# Altium project MachLoa.PrjPCB
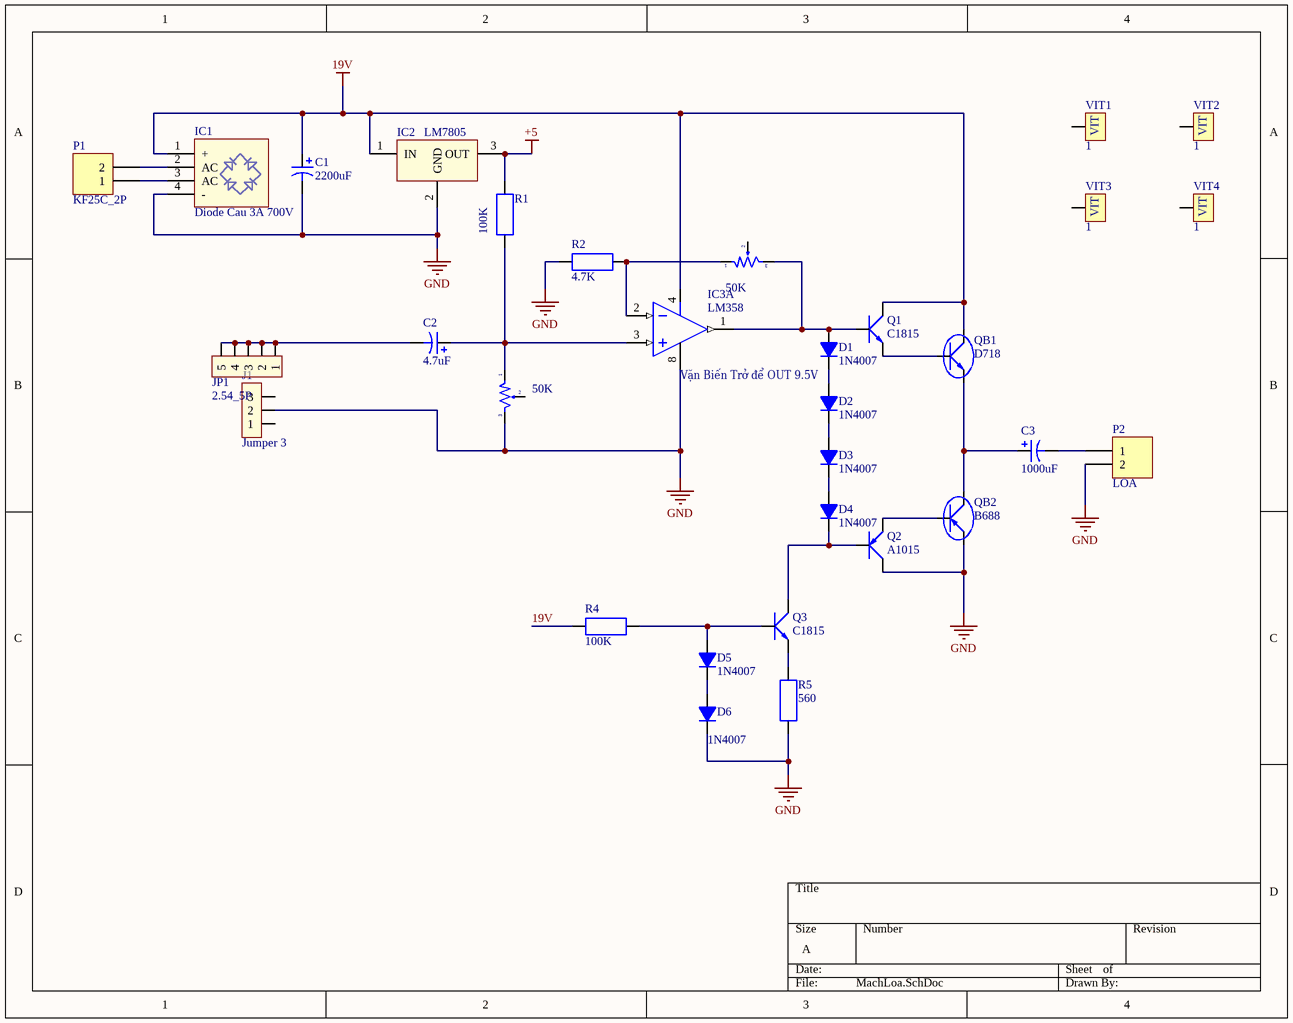
[diagram p0: MachLoa.SchDoc]
1 sheet, 31 parts. Net scope: global (net labels, ports and power ports of the same name join across sheets).
Board file: MachLoa.PcbDoc

## Sheet MachLoa.SchDoc
size A

### Parts
C1  2200uF  [C10mm]
C2  4.7uF  [C10mm]
C3  1000uF  [C10mm]
D1  1N4007  [D1A]
D2  1N4007  [D1A]
D3  1N4007  [D1A]
D4  1N4007  [D1A]
D5  1N4007  [D1A]
D6  1N4007  [D1A]
IC1  Diode Cau 3A 700V  [diode cau]
IC2  LM7805  [QTO-220H3]
IC3  LM358  [DIP8/W0.3]  (part A of 2)
J1  Jumper 3  [JP3]
JP1  2.54_5P  [jump don duc 2.54_5p]
P1  KF25C_2P  [KF25C_2P]
P2  LOA  [KF25C_2P]
Q1  C1815  [QTO-92]
Q2  A1015  [QTO-92]
Q3  C1815  [QTO-92]
QB1  D718  [QTO-247]
QB2  B688  [QTO-247]
R1  100K  [R2W]
R2  4.7K  [R2W]
R4  100K  [R2W]
R5  560  [R2W]
VIT1  1  [VIT]
VIT2  1  [VIT]
VIT3  1  [VIT]
VIT4  1  [VIT]
Volum1  50K  [BIEN TRO VI CHINH Dung]  (part A of 2)
Volum2  50K  [VOL-D]  (part A of 2)

### Nets
19V: C1.1 IC1.1(+) IC2.1(IN) IC3.4(-V) Q1.2(C) QB1.2(C) R4.2
+5: IC2.3(OUT) R1.2
GND: C1.2 D6.2(K) IC1.4(-) IC2.2(GND) IC3.8(+V) J1.2 P2.2 Q2.2(C) QB2.3(E) R2.2 R5.2 Volum1.3
NetC2_1: C2.1 IC3.3(IN+) R1.1 Volum1.1
NetC2_2: C2.2 JP1.1 JP1.2 JP1.3 JP1.4 JP1.5
NetC3_1: C3.1 QB1.3(E) QB2.2(C)
NetC3_2: C3.2 P2.1
NetD1_1: D1.1(A) IC3.1(OUT) Q1.3(B) Volum2.3
NetD1_2: D1.2(K) D2.1(A)
NetD2_2: D2.2(K) D3.1(A)
NetD3_2: D3.2(K) D4.1(A)
NetD4_2: D4.2(K) Q2.3(B) Q3.2(C)
NetD5_1: D5.1(A) Q3.3(B) R4.1
NetD5_2: D5.2(K) D6.1(A)
NetIC1_2: IC1.2(AC) P1.2
NetIC1_3: IC1.3(AC) P1.1
NetIC3_2: IC3.2(IN-) R2.1 Volum2.1
NetQ1_1: Q1.1(E) QB1.1(B)
NetQ2_1: Q2.1(E) QB2.1(B)
NetQ3_1: Q3.1(E) R5.1

Not connected (* = marked no-connect by the designer): J1 1 3; VIT1 VIT1(1); VIT2 VIT1(1); VIT3 VIT1(1); VIT4 VIT1(1); Volum1 2; Volum2 2

### Notes on the sheet
- Vặn Biến Trở để OUT 9.5V

### Library data of the parts
C1-C3 = Cap Pol 12mm: Polarized Capacitor (Axial); Published: 8-Jun-2000; LatestRevisionDate: 17-Jul-2002; LatestRevisionNote: Re-released for DXP Platform.; PackageReference: POLAR0.8; Publisher: Altium Limited
D1-D6 = D1A: Diode 1A; Value: 1N4007
IC1 = Diode Cau 3A 700V: Cắm; So_Chan: 4; Don_Vi: Con; Ten_Linh_Kien: Diode Cầu 3A 700V KBP307 (Vuông); Ma_Hang: MH001207; Chung_Loai: Cắm; Kieu_Chan: *
IC2 = LM78xx: On ap +, from + 5 to + 24VDC; Value: LM7805
IC3 = LM358: Low-Power Dual Operational Amplifier; Value: LM358
J1 = JP3: Value: J3
JP1 = Jump Don Duc 2.54_5P: Cắm; Ten_Linh_Kien: Jump Đơn Đực 2.54MM 2x40P Thẳng 11MM; Don_Vi: Con; So_Chan: 5; Ma_Hang: MH000903; Kieu_Chan: *; Chung_Loai: Cắm
P1 P2 = KF25C_2P: Header, 2-Pin, pitch 7.62mm; Solder: WAVE; MPN: KF25C_2P; Value: KF25C_2P
Q1 Q3 = C1815: NPN 600mW, ECB; Value: C1815
Q2 = A1015: PNP 600mW, ECB; Value: A1015
QB1 = D718: Transistor Power Supply; Value: D718
QB2 = B688: Transistor Power Supply; Value: B688
R1 R2 R4 R5 = R2W: Resistor 2W; Value: R2W - 47
VIT1-VIT4 = VIT: Oc Vit
Volum1 Volum2 = VOL-D: Volume control Dual; Value: Volume Dual 50K